# EAGLE schematic Tilt-PIC12F635 + 4N35 (EAGLE 6.4)
Circuito per prelevare gli impulsi provenienti da un tilt e creare impulsi di lunghezza determinata
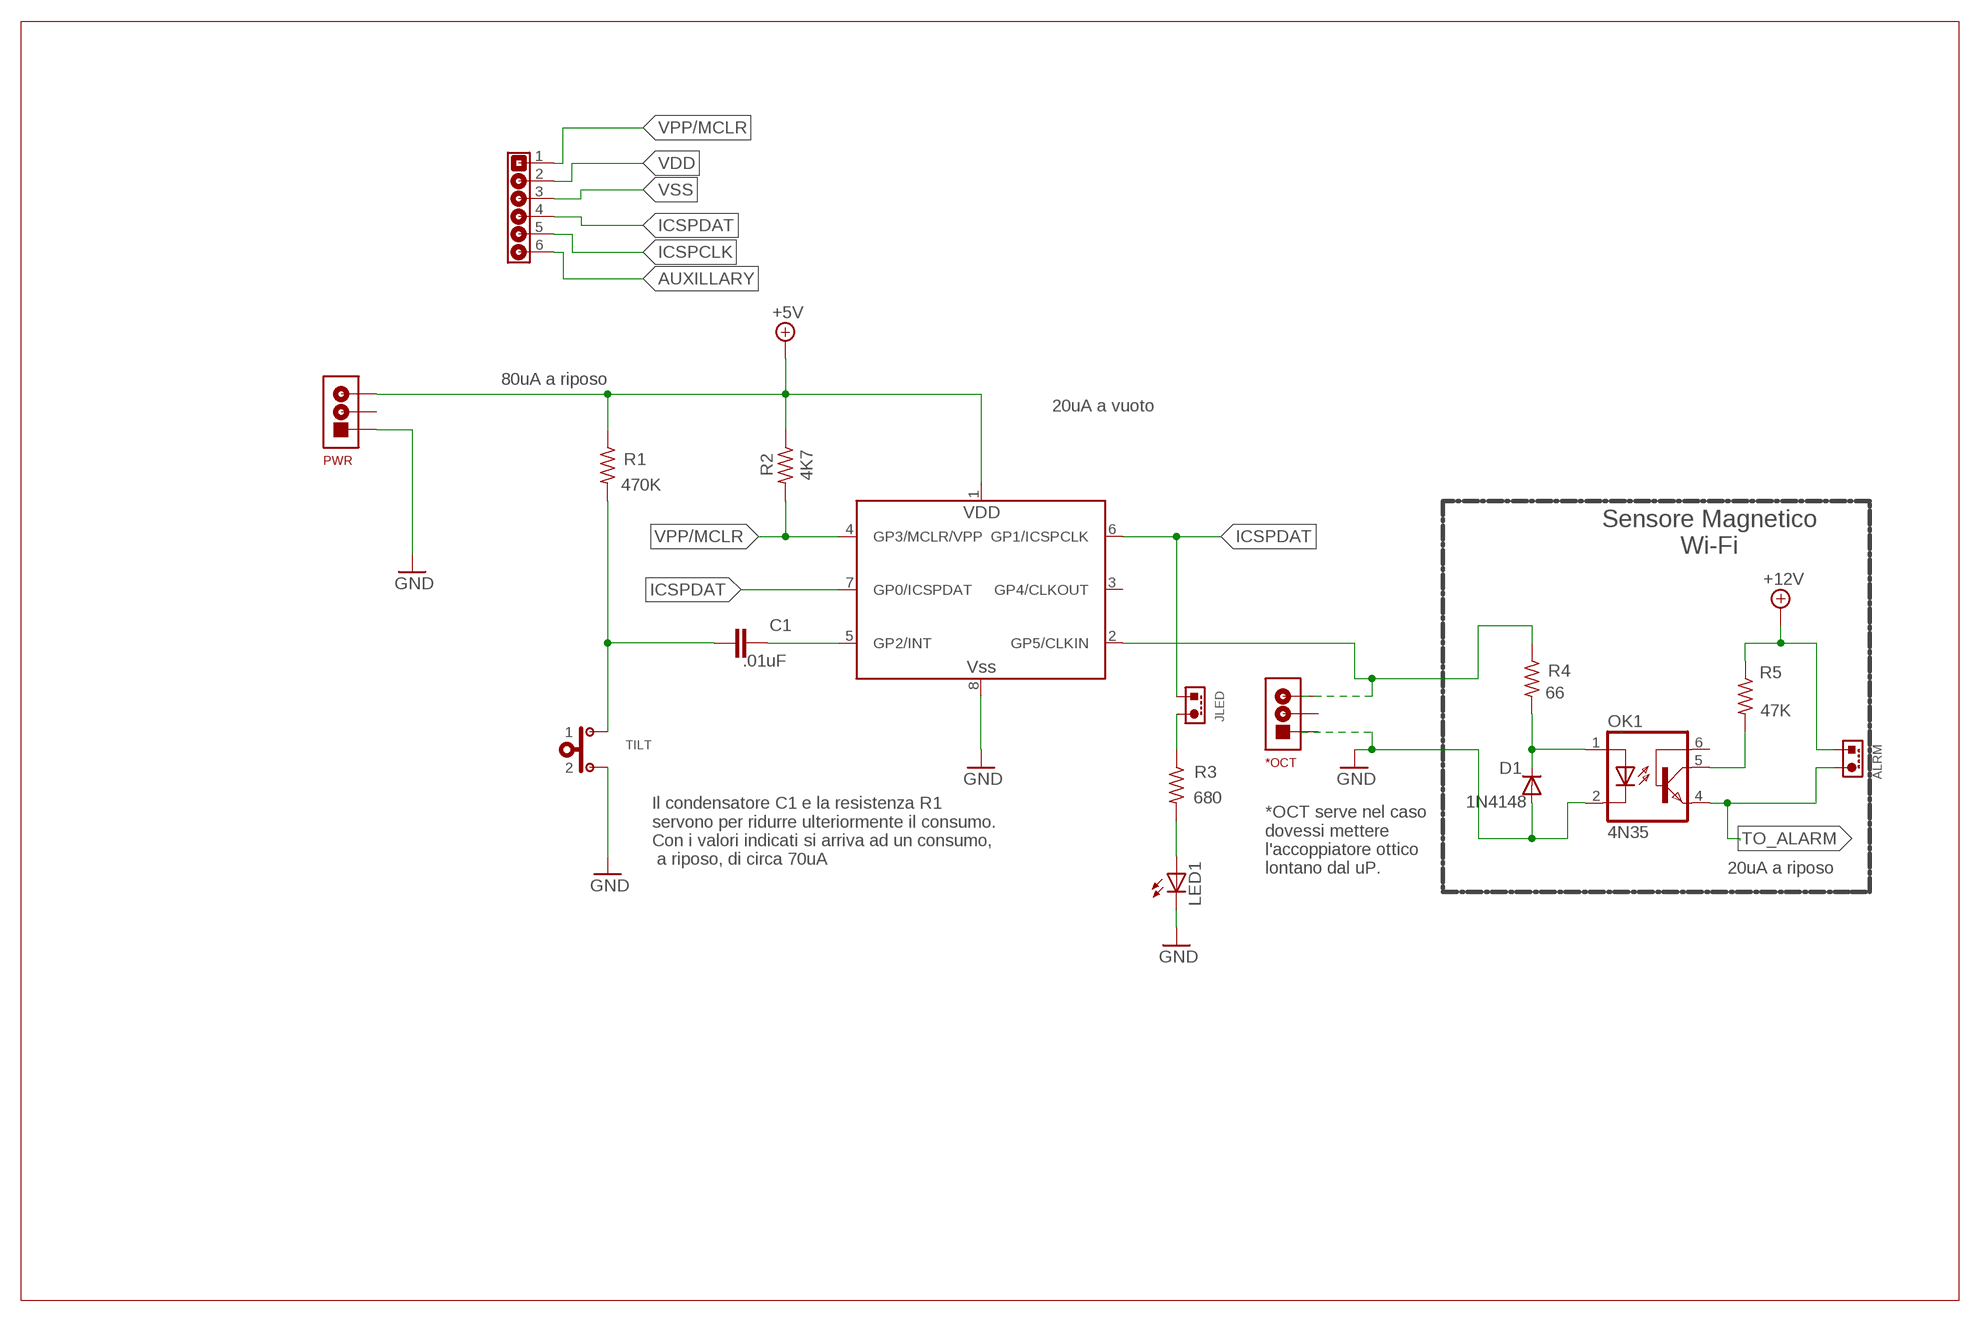
[diagram p0: schematic, sheet 1]

## Parts
*OCT  MAMMUTH03  [MAMMUTH03]
ALRM  JUMPER2X1  [SIP02]
C1  .01uF  C-EU025-024X044  [C025-024X044]
D1  1N4148  1N4148DO35-10  [DO35-10]
JLED  JUMPER2X1  [SIP02]
LED1  LED5MM  [LED5MM]
OK1  4N35  [DIL06]
PWR  MAMMUTH03  [MAMMUTH03]
R1  470K  R-US_0207/12  [0207/12]
R2  4K7  R-US_0207/12  [0207/12]
R3  680  R-US_0207/12  [0207/12]
R4  66  R-US_0207/12  [0207/12]
R5  47K  R-US_0207/12  [0207/12]
TILT  PULSANTENO  [SIP02]
U$1  SIP06  [SIP06]
UP1  PIC12F635  [DIL8]

## Nets
+5V: PWR.P$3 R1.1 R2.1 UP1.1(VDD)
+12V: ALRM.1 R5.1
AUXILLARY: U$1.6
GND: D1.A OK1.2(C) PWR.P$1 TILT.2
ICSPCLK: U$1.5
ICSPDAT: JLED.1 U$1.4 UP1.6(GP1/ICSPCLK)
N$2: LED1.A R3.2
N$3: R4.1 UP1.2(GP5/CLKIN)
N$4: C1.2 UP1.5(GP2/INT)
N$6: JLED.2 R3.1
N$7: D1.C OK1.1(A) R4.2
N$8: OK1.5(COL) R5.2
TILT: C1.1 R1.2 TILT.1
TO_ALARM: ALRM.2 OK1.4(EMI)
VDD: U$1.2
VPP/MCLR: R2.2 U$1.1 UP1.4(GP3/MCLR/VPP)
VSS: LED1.K(C) U$1.3 UP1.8(VSS) ; supply symbol labelled GND
Unconnected: *OCT.P$1 *OCT.P$2 *OCT.P$3 OK1.6(BAS) PWR.P$2 UP1.3(GP4/CLKOUT) UP1.7(GP0/ICSPDAT)

## Notes on the sheet
- 80uA a riposo
- 20uA a vuoto
- Sensore Magnetico
  Wi-Fi
- Il condensatore C1 e la resistenza R1
  servono per ridurre ulteriormente il consumo.
  Con i valori indicati si arriva ad un consumo,
   a riposo, di circa 70uA
- *OCT serve nel caso 
  dovessi mettere 
  l'accoppiatore ottico 
  lontano dal uP.
- 20uA a riposo

## Library data of the parts
*OCT PWR = Ln-Varie:MAMMUTH03: Mammuth 03
ALRM JLED = Ln-Varie:JUMPER2X1
C1 = Ln-RCL:C-EU: CAPACITOR, European symbol
D1 = diode:1N4148: DIODE high speed (Philips)
LED1 = Ln-TransDiodi:LED: LED OSRAM: - CHIPLED LG R971, LG N971, LY N971, LG Q971, LY Q971, LO R971, LY R971 LH N974, LH R974 LS Q976, LO Q976, LY Q976 LO Q996 - Hyper CHIPLED LW Q18S LB Q993, LB Q99A, LB R99A - SideLED LS A670, LO A670, LY A670, LG A670, LP A670 LB A673, LV A673, LT A673, LW A673 LH A674 LY A675 LS A676, LA A676, LO A676, LY A676, LW A676 LS A679, LY A679, LG A679 - Hyper Micro SIDELED® LS Y876, LA Y876, LO Y876, LY Y876 LT Y87S - SmartLED LW L88C, LW L88S LB L89C, LB L89S, LG L890 LS L89K, LO L89K, LY L89K LS L896, LA L896, LO L896, LY L896 - TOPLED LS T670, LO T670, LY T670, LG T670, LP T670 LSG T670, LSP T670, LSY T670, LOP T670, LYG T670 LG T671, LOG T671, LSG T671 LB T673, LV T673, LT T673, LW T673 LH T674 LS T676, LA T676, LO T676, LY T676, LB T676, LH T676, LSB T676, LW T676 LB T67C, LV T67C, LT T67C, LS T67K, LO T67K, LY T67K, LW E67C LS E67B, LA E67B, LO E67B, LY E67B, LB E67C, LV E67C, LT E67C LW T67C LS T679, LY T679, LG T679 LS T770, LO T770, LY T770, LG T770, LP T770 LB T773, LV T773, LT T773, LW T773 LH T774 LS E675, LA E675, LY E675, LS T675 LS T776, LA T776, LO T776, LY T776, LB T776 LHGB T686 LT T68C, LB T68C - Hyper Mini TOPLED® LB M676 - Mini TOPLED Santana® LG M470 LS M47K, LO M47K, LY M47K Source: http://www.osram.convergy.de LUXEON: - LUMILED® LXK2-PW12-R00, LXK2-PW12-S00, LXK2-PW14-U00, LXK2-PW14-V00 LXK2-PM12-R00, LXK2-PM12-S00, LXK2-PM14-U00 LXK2-PE12-Q00, LXK2-PE12-R00, LXK2-PE12-S00, LXK2-PE14-T00, LXK2-PE14-U00 LXK2-PB12-K00, LXK2-PB12-L00, LXK2-PB12-M00, LXK2-PB14-N00, LXK2-PB14-P00, LXK2-PB14-Q00 LXK2-PR12-L00, LXK2-PR12-M00, LXK2-PR14-Q00, LXK2-PR14-R00 LXK2-PD12-Q00, LXK2-PD12-R00, LXK2-PD12-S00 LXK2-PH12-R00, LXK2-PH12-S00 LXK2-PL12-P00, LXK2-PL12-Q00, LXK2-PL12-R00 Source: www.luxeon.com KINGBRIGHT: KA-3528ASYC Source: www.kingbright.com
OK1 = Ln-TransDiodi:4N35: MOTOROLA OPTO COUPLER; MF: FAIRCHILD SEMICONDUCTOR; MPN: 4N35; OC_FARNELL: 1328375; OC_NEWARK: 72K9946
R1-R5 = rcl:R-US_: RESISTOR, American symbol
TILT = Ln-Varie:PULSANTENO: Pulsante NO
U$1 = Ln-Varie:SIP06
UP1 = LN-microchip:PIC12F635